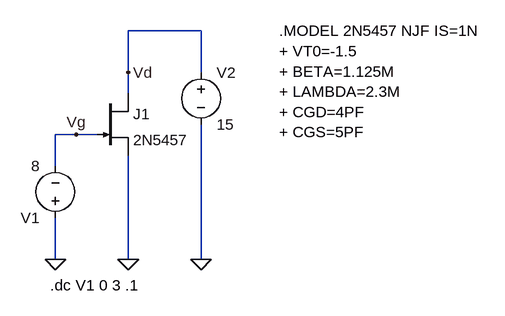
[diagram p0: schematic ej2.asc]
ej2.asc, the LTspice schematic file:
Version 4.1
SHEET 1 880 680
WIRE 320 0 208 0
WIRE 208 64 208 0
WIRE 320 64 320 0
WIRE 208 96 208 64
WIRE 128 160 96 160
WIRE 160 160 128 160
WIRE 96 208 96 160
WIRE 96 352 96 288
WIRE 208 352 208 192
WIRE 320 352 320 144
FLAG 208 352 0
FLAG 96 352 0
FLAG 320 352 0
FLAG 208 64 Vd
FLAG 128 160 Vg
SYMBOL njf 160 96 R0
SYMATTR InstName J1
SYMATTR Value 2N5457
SYMBOL voltage 96 304 R180
WINDOW 123 0 0 Left 0
WINDOW 39 0 0 Left 0
SYMATTR InstName V1
SYMATTR Value 8
SYMBOL voltage 320 48 R0
WINDOW 123 0 0 Left 0
WINDOW 39 0 0 Left 0
SYMATTR InstName V2
SYMATTR Value 15
TEXT 440 0 Left 2 !.MODEL 2N5457 NJF IS=1N \n+ VT0=-1.5\n+ BETA=1.125M\n+ LAMBDA=2.3M\n+ CGD=4PF\n+ CGS=5PF
TEXT 88 392 Left 2 !.dc V1 0 3 .1

The netlist it stands for:
* ej2.asc
J1 Vd Vg 0 2N5457
V1 0 Vg 8
V2 Vd 0 15
.model NJF NJF
.model PJF PJF
.lib standard.jft
.MODEL 2N5457 NJF IS=1N
+ VT0=-1.5
+ BETA=1.125M
+ LAMBDA=2.3M
+ CGD=4PF
+ CGS=5PF
.dc V1 0 3 .1
.backanno
.end